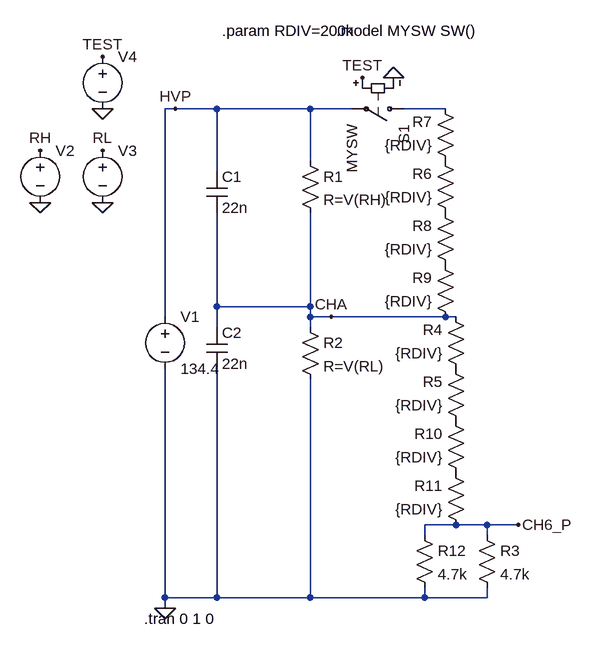
[diagram p0: schematic isolation-test.asc]
isolation-test.asc, the LTspice schematic file:
Version 4.1
SHEET 1 880 732
WIRE 0 -64 -16 -64
WIRE 64 -64 0 -64
WIRE 208 -64 64 -64
WIRE 272 -64 208 -64
WIRE 416 -64 352 -64
WIRE 208 16 208 -64
WIRE 64 32 64 -64
WIRE 64 240 64 96
WIRE 208 240 208 96
WIRE 208 240 64 240
WIRE -16 256 -16 -64
WIRE 208 256 208 240
WIRE 240 256 208 256
WIRE 416 256 240 256
WIRE 432 256 416 256
WIRE 64 272 64 240
WIRE 208 272 208 256
WIRE 432 576 384 576
WIRE 480 576 432 576
WIRE 528 576 480 576
WIRE 384 592 384 576
WIRE 480 592 480 576
WIRE -16 688 -16 336
WIRE 64 688 64 336
WIRE 64 688 -16 688
WIRE 208 688 208 352
WIRE 208 688 64 688
WIRE 384 688 384 672
WIRE 384 688 208 688
WIRE 480 688 480 672
WIRE 480 688 384 688
WIRE -16 704 -16 688
FLAG -16 704 0
FLAG 0 -64 HVP
FLAG -208 80 0
FLAG -112 80 0
FLAG -208 0 RH
FLAG -112 0 RL
FLAG 240 256 CHA
FLAG 528 576 CH6_P
FLAG 336 -112 0
FLAG -112 -64 0
FLAG -112 -144 TEST
FLAG 288 -112 TEST
SYMBOL voltage -16 240 R0
WINDOW 123 0 0 Left 0
WINDOW 39 0 0 Left 0
SYMATTR InstName V1
SYMATTR Value 134.4
SYMBOL res 192 0 R0
SYMATTR InstName R1
SYMATTR Value R=V(RH)
SYMBOL res 192 256 R0
SYMATTR InstName R2
SYMATTR Value R=V(RL)
SYMBOL voltage -208 -16 R0
WINDOW 3 24 96 Invisible 2
WINDOW 123 0 0 Left 0
WINDOW 39 0 0 Left 0
SYMATTR Value PULSE(10Meg 10 0 10m 10m 10m 100m)
SYMATTR InstName V2
SYMBOL voltage -112 -16 R0
WINDOW 3 24 96 Invisible 2
WINDOW 123 0 0 Left 0
WINDOW 39 0 0 Left 0
SYMATTR Value PULSE(10Meg 10 50m 10m 10m 10m 100m)
SYMATTR InstName V3
SYMBOL res 464 576 R0
SYMATTR InstName R3
SYMATTR Value 4.7k
SYMBOL res 432 32 R180
WINDOW 0 36 76 Left 2
WINDOW 3 36 40 Left 2
SYMATTR InstName R7
SYMATTR Value {RDIV}
SYMBOL sw 368 -64 R90
SYMATTR InstName S1
SYMATTR Value MYSW
SYMBOL voltage -112 -160 R0
WINDOW 3 24 96 Invisible 2
WINDOW 123 0 0 Left 0
WINDOW 39 0 0 Left 0
SYMATTR Value PULSE(0 1 0 1n 1n 300m 600m)
SYMATTR InstName V4
SYMBOL cap 48 272 R0
SYMATTR InstName C2
SYMATTR Value 22n
SYMBOL cap 48 32 R0
SYMATTR InstName C1
SYMATTR Value 22n
SYMBOL res 432 112 R180
WINDOW 0 36 76 Left 2
WINDOW 3 36 40 Left 2
SYMATTR InstName R6
SYMATTR Value {RDIV}
SYMBOL res 432 192 R180
WINDOW 0 36 76 Left 2
WINDOW 3 36 40 Left 2
SYMATTR InstName R8
SYMATTR Value {RDIV}
SYMBOL res 432 272 R180
WINDOW 0 36 76 Left 2
WINDOW 3 36 40 Left 2
SYMATTR InstName R9
SYMATTR Value {RDIV}
SYMBOL res 448 352 R180
WINDOW 0 36 76 Left 2
WINDOW 3 36 40 Left 2
SYMATTR InstName R4
SYMATTR Value {RDIV}
SYMBOL res 448 432 R180
WINDOW 0 36 76 Left 2
WINDOW 3 36 40 Left 2
SYMATTR InstName R5
SYMATTR Value {RDIV}
SYMBOL res 448 512 R180
WINDOW 0 36 76 Left 2
WINDOW 3 36 40 Left 2
SYMATTR InstName R10
SYMATTR Value {RDIV}
SYMBOL res 448 592 R180
WINDOW 0 36 76 Left 2
WINDOW 3 36 40 Left 2
SYMATTR InstName R11
SYMATTR Value {RDIV}
SYMBOL res 368 576 R0
SYMATTR InstName R12
SYMATTR Value 4.7k
TEXT -48 720 Left 2 !.tran 0 1 0
TEXT 248 -184 Left 2 !.model MYSW SW()
TEXT 72 -184 Left 2 !.param RDIV=200k

The netlist it stands for:
* isolation-test.asc
V1 HVP 0 134.4
R1 HVP CHA R=V(RH)
R2 CHA 0 R=V(RL)
V2 RH 0 PULSE(10Meg 10 0 10m 10m 10m 100m)
V3 RL 0 PULSE(10Meg 10 50m 10m 10m 10m 100m)
R3 CH6_P 0 4.7k
R7 P001 N001 {RDIV}
S1 N001 HVP TEST 0 MYSW
V4 TEST 0 PULSE(0 1 0 1n 1n 300m 600m)
C2 CHA 0 22n
C1 HVP CHA 22n
R6 P002 P001 {RDIV}
R8 P003 P002 {RDIV}
R9 CHA P003 {RDIV}
R4 P004 CHA {RDIV}
R5 P005 P004 {RDIV}
R10 P006 P005 {RDIV}
R11 CH6_P P006 {RDIV}
R12 CH6_P 0 4.7k
.tran 0 1 0
.model MYSW SW()
.param RDIV=200k
.backanno
.end